# Altium schematic sheet HD301_driver.SchDoc
size A2
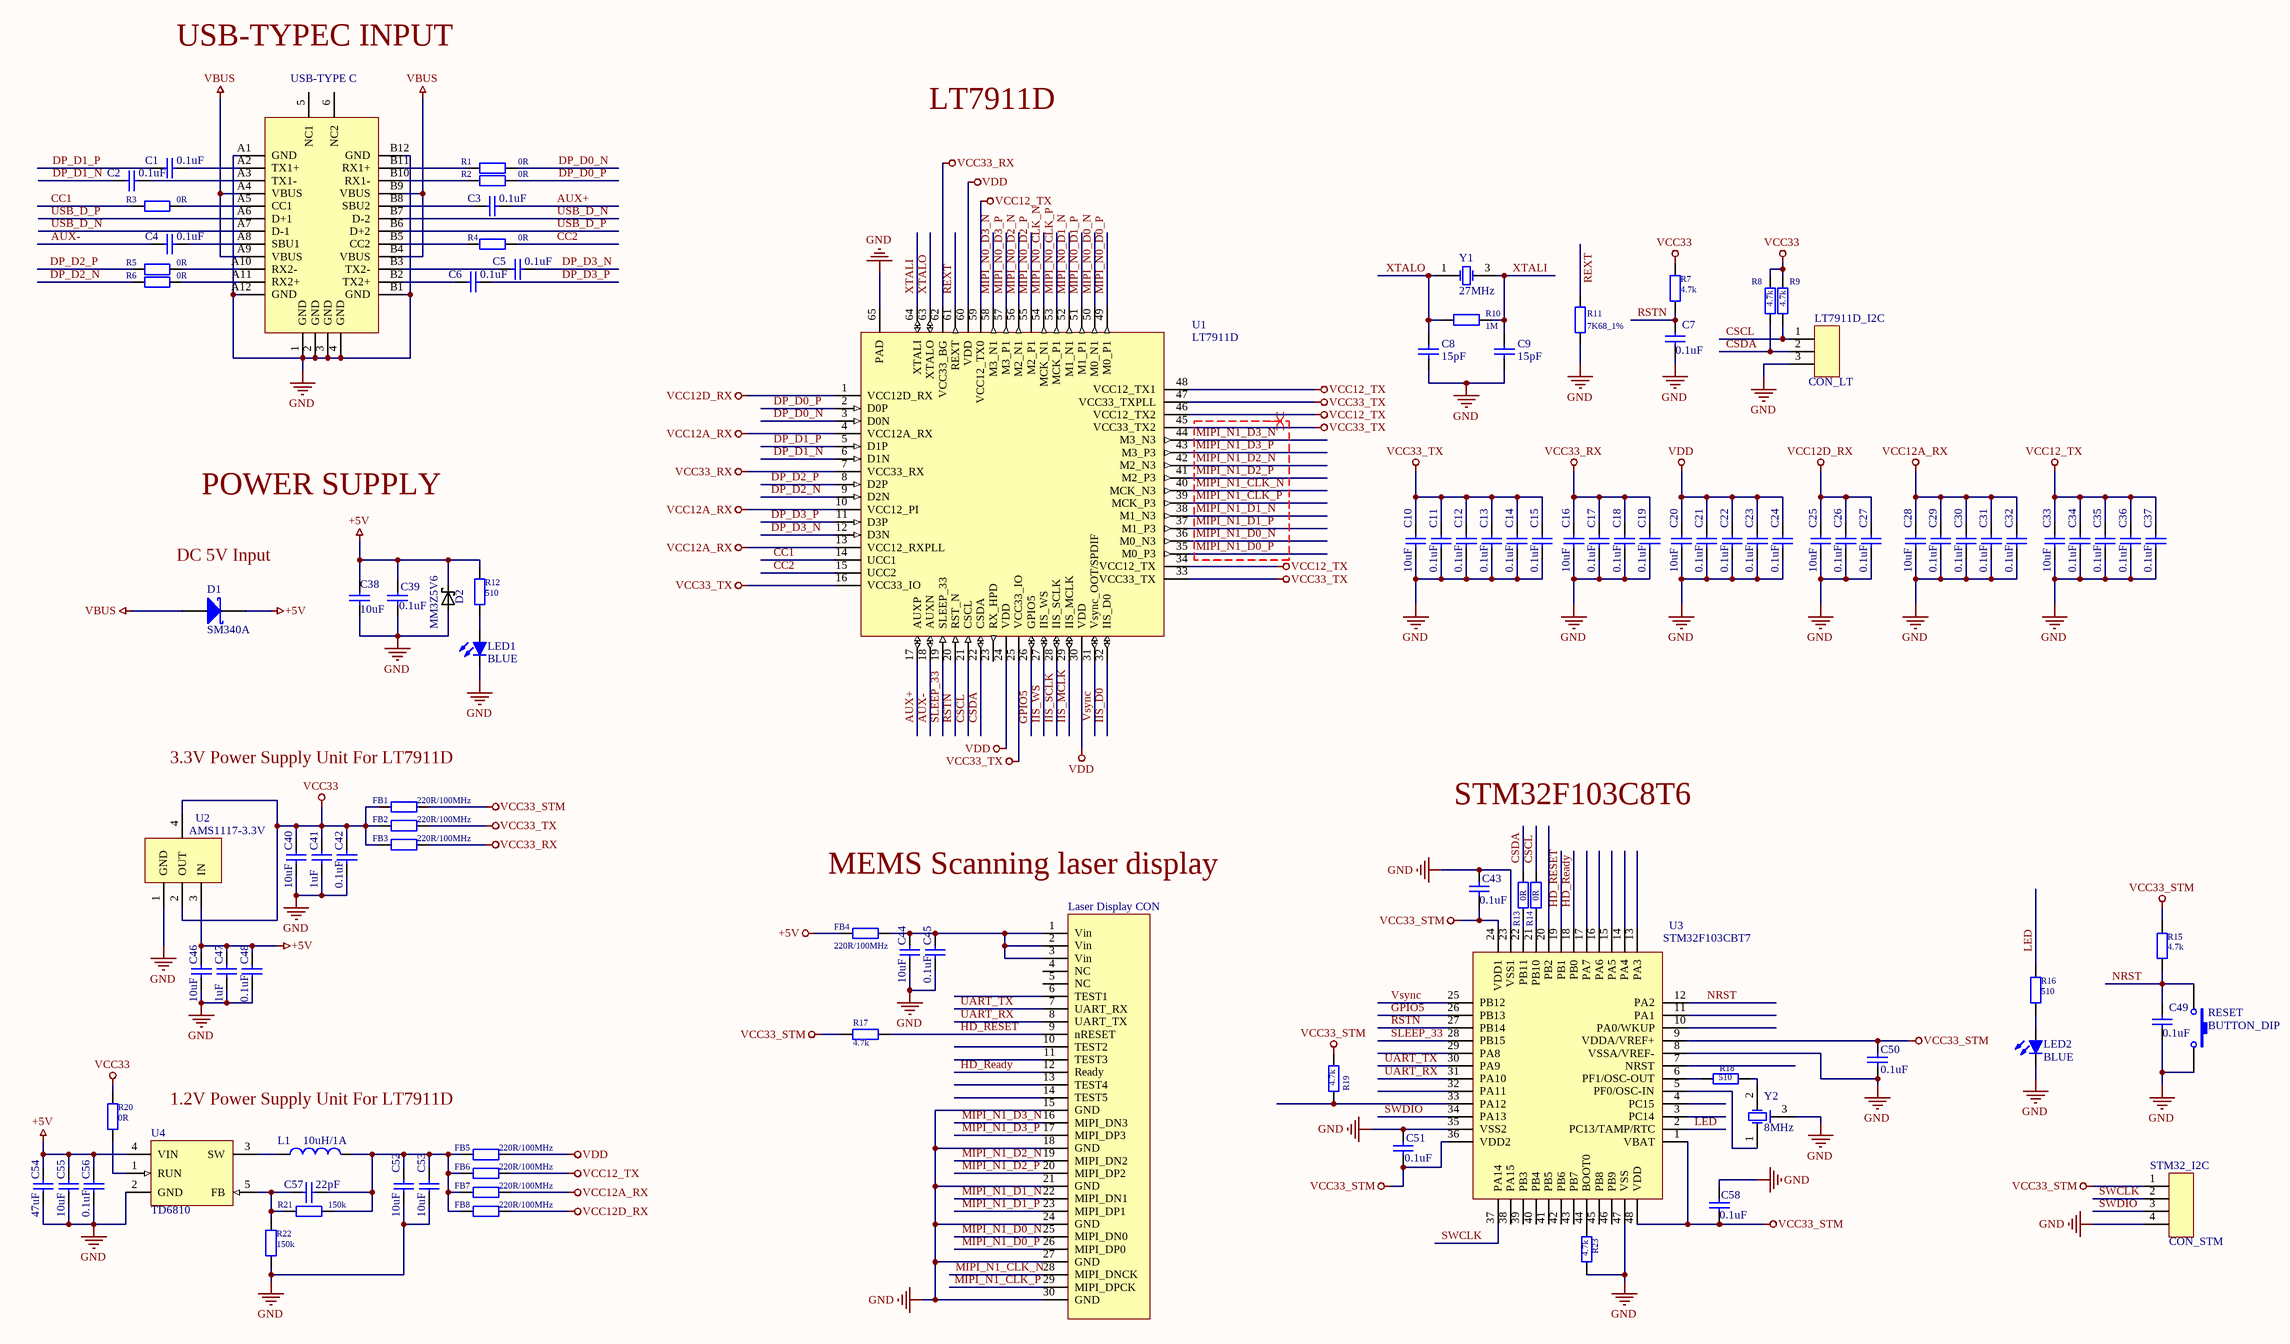
[diagram p0: HD301_driver.SchDoc]

## Parts
C1  0.1uF  [0402-C]
C2  0.1uF  [0402-C]
C3  0.1uF  [0402-C]
C4  0.1uF  [0402-C]
C5  0.1uF  [0402-C]
C6  0.1uF  [0402-C]
C7  0.1uF  [0402-C]
C8  15pF  [0402-C]
C9  15pF  [0402-C]
C10  10uF  [0603-C]
C11  0.1uF  [0402-C]
C12  0.1uF  [0402-C]
C13  0.1uF  [0402-C]
C14  0.1uF  [0402-C]
C15  0.1uF  [0402-C]
C16  10uF  [0603-C]
C17  0.1uF  [0402-C]
C18  0.1uF  [0402-C]
C19  0.1uF  [0402-C]
C20  10uF  [0603-C]
C21  0.1uF  [0402-C]
C22  0.1uF  [0402-C]
C23  0.1uF  [0402-C]
C24  0.1uF  [0402-C]
C25  10uF  [0603-C]
C26  0.1uF  [0402-C]
C27  0.1uF  [0402-C]
C28  10uF  [0603-C]
C29  0.1uF  [0402-C]
C30  0.1uF  [0402-C]
C31  0.1uF  [0402-C]
C32  0.1uF  [0402-C]
C33  10uF  [0603-C]
C34  0.1uF  [0402-C]
C35  0.1uF  [0402-C]
C36  0.1uF  [0402-C]
C37  0.1uF  [0402-C]
C38  10uF  [0603-C]
C39  0.1uF  [0402-C]
C40  10uF  [0603-C]
C41  1uF  [0603-C]
C42  0.1uF  [0402-C]
C43  0.1uF  [0402-C]
C44  10uF  [0603-C]
C45  0.1uF  [0402-C]
C46  10uF  [0603-C]
C47  1uF  [0603-C]
C48  0.1uF  [0402-C]
C49  0.1uF  [0402-C]
C50  0.1uF  [0402-C]
C51  0.1uF  [0402-C]
C52  10uF  [0603-C]
C53  10uF  [0603-C]
C54  47uF  [1206-C]
C55  10uF  [0603-C]
C56  0.1uF  [0402-C]
C57  22pF  [0402-C]
C58  0.1uF  [0402-C]
D1  SM340A  [SM340A_DO-214AC]
D2  MM3Z5V6  [PDZ_B-SOD323]
FB1  220R/100MHz  [0603-FB]
FB2  220R/100MHz  [0603-FB]
FB3  220R/100MHz  [0603-FB]
FB4  220R/100MHz  [0603-FB]
FB5  220R/100MHz  [0603-FB]
FB6  220R/100MHz  [0603-FB]
FB7  220R/100MHz  [0603-FB]
FB8  220R/100MHz  [0603-FB]
L1  10uH/1A  [Inductor_LPS4018-103MR]
Laser_Display_CON  MIPI-DSI  [50696-030-0-M]  (value not drawn)
LED1  BLUE  [SMD_LED(0603)]
LED2  BLUE  [SMD_LED(0603)]
LT7911D_I2C  CON_LT  [Header-Female-2.54*3]
R1  0R  [0402-R]
R2  0R  [0402-R]
R3  0R  [0402-R]
R4  0R  [0402-R]
R5  0R  [0402-R]
R6  0R  [0402-R]
R7  4.7k  [0402-R]
R8  4.7k  [0402-R]
R9  4.7k  [0402-R]
R10  1M  [0402-R]
R11  7K68_1%  [0402-R]
R12  510  [0402-R]
R13  0R  [0402-R]
R14  0R  [0402-R]
R15  4.7k  [0402-R]
R16  510  [0402-R]
R17  4.7k  [0402-R]
R18  510  [0402-R]
R19  4.7k  [0402-R]
R20  0R  [0402-R]
R21  150k  [0402-R]
R22  150k  [0402-R]
R23  4.7k  [0402-R]
RESET  BUTTON_DIP  [Push button_mini(2 pin)]
STM32_I2C  CON_STM  [Header-Female-2.54*4]
U1  LT7911D  [QFN64_EPAD]
U2  AMS1117-3.3V  [AMS1117_SOT-223_4]
U3  STM32F103CBT7  [LQFP48-7mm*7mm]
U4  TD6810  [TD6810_SOT23-5]
USB-TYPE_C  USB-TYPEC  [USB_TYPEC_RECEPTACLE_DIP]  (value not drawn)
Y1  27MHz  [CRY_3225]
Y2  8MHz  [Resonator_mini]

## Nets
+5V: C38.1 C39.2 C46.1 C47.1 C48.1 C54.1 C55.1 C56.1 D1.C D2.C FB4.1 R12.1 U2.3(IN) U4.4(VIN)
GND: C7.2 C8.2 C9.2 C10.2 C11.2 C12.2 C13.2 C14.2 C15.2 C16.2 C17.2 C18.2 C19.2 C20.2 C21.2 C22.2 C23.2 C24.2 C25.2 C26.2 C27.2 C28.2 C29.2 C30.2 C31.2 C32.2 C33.2 C34.2 C35.2 C36.2 C37.2 C38.2 C39.1 C40.2 C41.2 C42.2 C43.2 C44.2 C45.2 C46.2 C47.2 C48.2 C49.2 C50.1 C51.2 C52.2 C53.2 C54.2 C55.2 C56.2 C58.2 D2.A Laser_Display_CON.15(GND) Laser_Display_CON.18(GND) Laser_Display_CON.21(GND) Laser_Display_CON.24(GND) Laser_Display_CON.27(GND) Laser_Display_CON.30(GND) LED1.2(K) LED2.2(K) LT7911D_I2C.3 R11.1 R22.1 R23.1 RESET.2 STM32_I2C.4 U1.65(PAD) U2.1(GND) U3.8(VSSA/VREF-) U3.23(VSS1) U3.35(VSS2) U3.47(VSS) U4.2(GND) USB-TYPE_C.1(GND) USB-TYPE_C.2(GND) USB-TYPE_C.3(GND) USB-TYPE_C.4(GND) USB-TYPE_C.A1(GND) USB-TYPE_C.A12(GND) USB-TYPE_C.B1(GND) USB-TYPE_C.B12(GND) Y2.3(OSC2)
VBUS: D1.A USB-TYPE_C.A4(VBUS) USB-TYPE_C.A9(VBUS) USB-TYPE_C.B4(VBUS) USB-TYPE_C.B9(VBUS)
VCC12_TX: C33.1 C34.1 C35.1 C36.1 C37.1 FB6.2 U1.34(VCC12_TX) U1.46(VCC12_TX2) U1.48(VCC12_TX1) U1.59(VCC12_TX0)
VCC12A_RX: C28.1 C29.1 C30.1 C31.1 C32.1 FB7.2 U1.4(VCC12A_RX) U1.10(VCC12_PI) U1.13(VCC12_RXPLL)
VCC12D_RX: C25.1 C26.1 C27.1 FB8.2 U1.1(VCC12D_RX)
VCC33: C40.1 C41.1 C42.1 FB1.1 FB2.1 FB3.1 R7.1 R8.2 R9.2 R20.1 U2.2(OUT) U2.4(OUT)
VCC33_RX: C16.1 C17.1 C18.1 C19.1 FB3.2 U1.7(VCC33_RX) U1.62(VCC33_BG)
VCC33_STM: C43.1 C50.2 C51.1 C58.1 FB1.2 R15.1 R17.2 R19.2 STM32_I2C.1 U3.1(VBAT) U3.9(VDDA/VREF+) U3.24(VDD1) U3.36(VDD2) U3.48(VDD)
VCC33_TX: C10.1 C11.1 C12.1 C13.1 C14.1 C15.1 FB2.2 U1.16(VCC33_IO) U1.25(VCC33_IO) U1.33(VCC33_TX) U1.45(VCC33_TX2) U1.47(VCC33_TXPLL)
VDD: C20.1 C21.1 C22.1 C23.1 C24.1 FB5.2 U1.24(VDD) U1.30(VDD) U1.60(VDD)
AUX+: C3.2 U1.17(AUXP)
AUX-: C4.2 U1.18(AUXN)
CC1: R3.2 U1.14(UCC1)
CC2: R4.1 U1.15(UCC2)
CSCL: LT7911D_I2C.1 R9.1 R14.2 U1.21(CSCL)
CSDA: LT7911D_I2C.2 R8.1 R13.2 U1.22(CSDA)
DP_D0_N: R1.1 U1.3(D0N)
DP_D0_P: R2.1 U1.2(D0P)
DP_D1_N: C2.2 U1.6(D1N)
DP_D1_P: C1.2 U1.5(D1P)
DP_D2_N: R6.2 U1.9(D2N)
DP_D2_P: R5.2 U1.8(D2P)
DP_D3_N: C5.2 U1.12(D3N)
DP_D3_P: C6.2 U1.11(D3P)
GPIO5: U1.26(GPIO5) U3.26(PB13)
HD_Ready: Laser_Display_CON.12(Ready) U3.18(PB0)
HD_RESET: Laser_Display_CON.9(nRESET) R17.1 U3.19(PB1)
IIS_D0: U1.32(IIS_D0)
IIS_MCLK: U1.29(IIS_MCLK)
IIS_SCLK: U1.28(IIS_SCLK)
IIS_WS: U1.27(IIS_WS)
LED: R16.1 U3.2(PC13/TAMP/RTC)
MIPI_N0_CLK_N: U1.54(MCK_N1)
MIPI_N0_CLK_P: U1.53(MCK_P1)
MIPI_N0_D0_N: U1.50(M0_N1)
MIPI_N0_D0_P: U1.49(M0_P1)
MIPI_N0_D1_N: U1.52(M1_N1)
MIPI_N0_D1_P: U1.51(M1_P1)
MIPI_N0_D2_N: U1.56(M2_N1)
MIPI_N0_D2_P: U1.55(M2_P1)
MIPI_N0_D3_N: U1.58(M3_N1)
MIPI_N0_D3_P: U1.57(M3_P1)
MIPI_N1_CLK_N: Laser_Display_CON.28(MIPI_DNCK) U1.40(MCK_N3)
MIPI_N1_CLK_P: Laser_Display_CON.29(MIPI_DPCK) U1.39(MCK_P3)
MIPI_N1_D0_N: Laser_Display_CON.25(MIPI_DN0) U1.36(M0_N3)
MIPI_N1_D0_P: Laser_Display_CON.26(MIPI_DP0) U1.35(M0_P3)
MIPI_N1_D1_N: Laser_Display_CON.22(MIPI_DN1) U1.38(M1_N3)
MIPI_N1_D1_P: Laser_Display_CON.23(MIPI_DP1) U1.37(M1_P3)
MIPI_N1_D2_N: Laser_Display_CON.19(MIPI_DN2) U1.42(M2_N3)
MIPI_N1_D2_P: Laser_Display_CON.20(MIPI_DP2) U1.41(M2_P3)
MIPI_N1_D3_N: Laser_Display_CON.16(MIPI_DN3) U1.44(M3_N3)
MIPI_N1_D3_P: Laser_Display_CON.17(MIPI_DP3) U1.43(M3_P3)
NRST: C49.1 R15.2 RESET.1 U3.12(PA2)
REXT: R11.2 U1.61(REXT)
RSTN: C7.1 R7.2 U1.20(RST_N) U3.27(PB14)
SLEEP_33: U1.19(SLEEP_33) U3.28(PB15)
SWCLK: STM32_I2C.2 U3.37(PA14)
SWDIO: STM32_I2C.3 U3.34(PA13)
UART_RX: Laser_Display_CON.8(UART_TX) U3.31(PA10)
UART_TX: Laser_Display_CON.7(UART_RX) U3.30(PA9)
USB_D_N: USB-TYPE_C.A7(D-1) USB-TYPE_C.B7(D-2)
USB_D_P: USB-TYPE_C.A6(D+1) USB-TYPE_C.B6(D+2)
Vsync: U1.31(Vsync_OOT/SPDIF) U3.25(PB12)
XTALI: C9.1 R10.2 U1.64(XTALI) Y1.3(OSC2)
XTALO: C8.1 R10.1 U1.63(XTALO) Y1.1(OSC1)
NetC1_1: C1.1 USB-TYPE_C.A2(TX1+)
NetC2_1: C2.1 USB-TYPE_C.A3(TX1-)
NetC3_1: C3.1 USB-TYPE_C.B8(SBU2)
NetC4_1: C4.1 USB-TYPE_C.A8(SBU1)
NetC5_1: C5.1 USB-TYPE_C.B3(TX2-)
NetC6_1: C6.1 USB-TYPE_C.B2(TX2+)
NetC44_1: C44.1 C45.1 FB4.2 Laser_Display_CON.1(Vin) Laser_Display_CON.2(Vin) Laser_Display_CON.3(Vin)
NetC52_1: C52.1 C53.1 C57.2 FB5.1 FB6.1 FB7.1 FB8.1 L1.2 R21.2
NetC57_1: C57.1 R21.1 R22.2 U4.5(FB)
NetL1_1: L1.1 U4.3(SW)
NetLED1_1: LED1.1(A) R12.2
NetLED2_1: LED2.1(A) R16.2
NetR1_2: R1.2 USB-TYPE_C.B11(RX1+)
NetR2_2: R2.2 USB-TYPE_C.B10(RX1-)
NetR3_1: R3.1 USB-TYPE_C.A5(CC1)
NetR4_2: R4.2 USB-TYPE_C.B5(CC2)
NetR5_1: R5.1 USB-TYPE_C.A10(RX2-)
NetR6_1: R6.1 USB-TYPE_C.A11(RX2+)
NetR13_1: R13.1 U3.22(PB11)
NetR14_1: R14.1 U3.21(PB10)
NetR18_1: R18.1 U3.6(PF1/OSC-OUT)
NetR18_2: R18.2 Y2.2(OSC2)
NetR19_1: R19.1 U3.33(PA12)
NetR20_2: R20.2 U4.1(RUN)
NetR23_2: R23.2 U3.44(BOOT0)
NetU3_5: U3.5(PF0/OSC-IN) Y2.1(OSC1)

Not connected (* = marked no-connect by the designer): Laser_Display_CON 4(NC) 5(NC) 6(TEST1) 10(TEST2) 11(TEST3) 13(TEST4) 14(TEST5); U1 23(RX_HPD); U3 3(PC14) 4(PC15) 7(NRST) 10(PA0/WKUP) 11(PA1) 13(PA3) 14(PA4) 15(PA5) 16(PA6) 17(PA7) 20(PB2) 29(PA8) 32(PA11) 38(PA15) 39(PB3) 40(PB4) 41(PB5) 42(PB6) 43(PB7) 45(PB8) 46(PB9); USB-TYPE_C 5(NC1) 6(NC2)

## Layout directives
differential pair: MIPI_N1_CLK_N, MIPI_N1_CLK_P, MIPI_N1_D0_N, MIPI_N1_D0_P, MIPI_N1_D1_N, MIPI_N1_D1_P, MIPI_N1_D2_N, MIPI_N1_D2_P, MIPI_N1_D3_N, MIPI_N1_D3_P

## Notes on the sheet
- USB-TYPEC INPUT
- LT7911D
- POWER SUPPLY
- (near D1) DC 5V Input
- 3.3V Power Supply Unit For LT7911D
- STM32F103C8T6
- MEMS Scanning laser display
- 1.2V Power Supply Unit For LT7911D

## Library data of the parts
C1-C6 C10-C38 C40-C48 C50-C58 = Cap: Capacitor; Published: 8-Jun-2000; LatestRevisionDate: 17-Jul-2002; LatestRevisionNote: Re-released for DXP Platform.; PackageReference: RAD-0.3; Publisher: Altium Limited; PackageDescription: Radial Cap, Thru-Hole; 2 Leads; 0.3 in Pin Spacing
C7-C9 C49 = Cap: Capacitor; Value: 50V; Published: 8-Jun-2000; LatestRevisionDate: 17-Jul-2002; LatestRevisionNote: Re-released for DXP Platform.; PackageReference: RAD-0.3; Publisher: Altium Limited; PackageDescription: Radial Cap, Thru-Hole; 2 Leads; 0.3 in Pin Spacing
C39 = Cap: Capacitor; Value: 100V; Published: 8-Jun-2000; LatestRevisionDate: 17-Jul-2002; LatestRevisionNote: Re-released for DXP Platform.; PackageReference: RAD-0.3; Publisher: Altium Limited; PackageDescription: Radial Cap, Thru-Hole; 2 Leads; 0.3 in Pin Spacing
D1 = Diode 10TQ035: Schottky Rectifier; Note: Terminal 2 is the TAB and is electrically connected to the cathode; Published: 8-Jun-2000; LatestRevisionDate: 17-Jul-2002; LatestRevisionNote: Re-released for DXP Platform.; DatasheetVersion: PD-2.057B; PackageVersion: Feb-1998; PackageReference: TO-220AC; Publisher: Altium Limited; PackageDescription: TO, Thru-Hole, Vertical, Heatsink Mounted; 3 In-Line Leads (1 Absent); Pitch 2.54 mm; ComponentLink1Description: Manufacturer Link; ComponentLink1URL: http://www.irf.com/; ComponentLink2Description: Datasheet; ComponentLink2URL: http://www.irf.com/product-info/datasheets/data/10tq.pdf
D2 = BAT46W: MF: Diotec; Availability: Unavailable; SnapEDA_Link: https://www.snapeda.com/parts/BAT46W/Diotec/view-part/?ref=snap; MP: BAT46W; Price: None; Package: SOD-123 Diotec; Value: *
FB1-FB8 R1-R23 = Res2: Resistor; Published: 8-Jun-2000; LatestRevisionDate: 17-Jul-2002; LatestRevisionNote: Re-released for DXP Platform.; PackageReference: AXIAL-0.4; Publisher: Altium Limited; PackageDescription: Axial Device, Thru-Hole; 2 Leads; 0.4 in Pin Spacing
L1 = Inductor: Code_IEC: 1005; Value: 10mH; Published: 8-Jun-2000; LatestRevisionDate: 29-May-2009; LatestRevisionNote: IPC-7351 Footprint Added.; PackageReference: 0402-A; Publisher: Altium Limited; PackageDescription: Chip Inductor; Code_JEITA: 0402
LED1 LED2 = LED1: Typical RED GaAs LED; Published: Yellow; LatestRevisionDate: 08-Jul-2005; LatestRevisionNote: Mech Layer 1 removed.; PackageReference: LED-1; Publisher: Altium Limited; PackageDescription: LED; 2 Leads
LT7911D_I2C = 3PinConnector
RESET = SW-PB: Switch; Published: 24-Mar-1999; LatestRevisionDate: 17-Jul-2002; LatestRevisionNote: Re-released for DXP Platform.; PackageReference: SPST-2; Publisher: Altium Limited; PackageDescription: Switch; 2 Leads
STM32_I2C = 4PinConnector
U1 = LT7911D: USB/MIPI port converter
U2 = AMS1117-3.3V: 3.3V Voltage Regulator
U3 = STM32F303CBT7: 32bit MCU
U4 = TD6810: voltage regulater; Published: 8-Jun-2000; LatestRevisionDate: 17-Jul-2002; LatestRevisionNote: Re-released for DXP Platform.; DatasheetVersion: REV. B; PackageVersion: 1990; PackageReference: H-08A; Publisher: Altium Limited; PackageDescription: Can; 8 Leads; Pin Circle Dia. 5.08 mm; Lead Dia. 0.53 mm (max); ComponentLink1Description: Manufacturer Link; ComponentLink1URL: http://www.analog.com/
USB-TYPE_C = USB-TYPEC: USB-TYPEC INPUT
Y1 = XTAL_2: Crystal Oscillator; Published: 8-Jun-2000; LatestRevisionDate: 17-Jul-2002; LatestRevisionNote: Re-released for DXP Platform.; PackageReference: R38; Publisher: Altium Limited; PackageDescription: Crystal, Thru-Hole; 2 Leads; Body 3.1 x 8.2 mm (Dia.xH)
Y2 = XTAL: Crystal Oscillator; Published: 8-Jun-2000; LatestRevisionDate: 17-Jul-2002; LatestRevisionNote: Re-released for DXP Platform.; PackageReference: R38; Publisher: Altium Limited; PackageDescription: Crystal, Thru-Hole; 2 Leads; Body 3.1 x 8.2 mm (Dia.xH)